# Altium project fMUX_MB.PrjPCB (part 6 of 6)
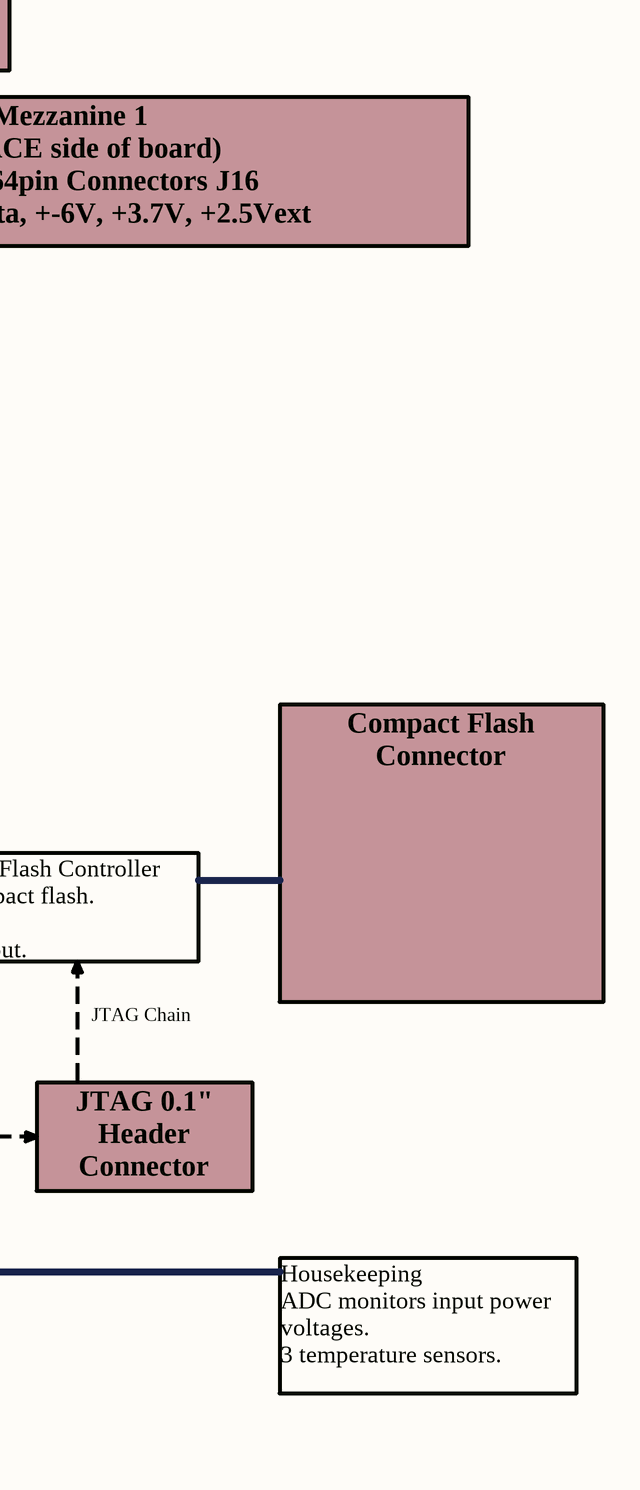
[diagram p29: fMuxBoardOverview.SchDoc, right]

## Nets that join several sheets
EXT5V5n: Power_Delivery (F2.1 P4.2), Eurocard VME 6U P2 (P2.B1 P2.B13 P2.B32), Housekeeping (RP18.2)
EXT5V5p: Power_Delivery (F1.1 P4.5), Eurocard VME 6U P1 (P1.A32 P1.B32 P1.C32), Housekeeping (RP10.2)
GND: Banks_1_2 (14 pins), Banks_3_4 (7 pins), Banks_5_6 (7 pins), Banks_7_8 (12 pins), Banks_9_10 (R123.2 R126.1), Banks_11_12 (R28.2 R29.1), Banks_13_14 (R31.2 R33.1), Power_Delivery (14 pins), U_Power_Delivery/BuckRegulator1 (27 pins), U_Power_Delivery/BuckRegulator2 (27 pins), U_Power_Delivery/BuckRegulator3 (27 pins), Linear_Pos_regulator (C325.2 C326.2 U33.3 U33.6), Clock_distrubution (7 pins), UserClock (C4.1 U5.2), DDR-Memory (36 pins), U_DDR-Memory/RTerm1 (CRT1_1.1), U_DDR-Memory/RTerm2 (CRT1_2.1), U_DDR-Memory/RTerm3 (CRT1_3.1), U_DDR-Memory/RTerm4 (CRT1_4.1), U_DDR-Memory/RTerm5 (CRT1_5.1), U_DDR-Memory/RTerm6 (CRT1_6.1), U_DDR-Memory/RTerm7 (CRT1_7.1), U_DDR-Memory/RTerm8 (CRT1_8.1), Eurocard VME 6U P1 (24 pins), Eurocard VME 6U P2 (6 pins), FPGA_Power (344 pins), Housekeeping (13 pins), U_Housekeeping/TemperatureSens1 (CTemp_1.2 UTemp_1.1), U_Housekeeping/TemperatureSens2 (CTemp_2.2 UTemp_2.1), U_Housekeeping/TemperatureSens3 (CTemp_3.2 UTemp_3.1), Mezz1 (13 pins), Mezz2 (13 pins), SysACE_SysFLASH (62 pins), Watchdog_Reset (R132.1 U29.2), Comm_SQUID (14 pins), SQUID_Power (22 pins), PHY_RJ45 (54 pins)
INT5V5n: Power_Delivery (C275.2 C276.2 L6.2), Housekeeping (RP5.1), Mezz1 (J16_2.83 J16_2.84), Mezz2 (J17_2.83 J17_2.84), SQUID_Power (C330.2 Q6.3 R160.2)
INT5V5p: Power_Delivery (5 pins), U_Power_Delivery/BuckRegulator1 (14 pins), U_Power_Delivery/BuckRegulator2 (14 pins), U_Power_Delivery/BuckRegulator3 (14 pins), Housekeeping (RP8.2), Mezz1 (J16_2.77 J16_2.78), Mezz2 (J17_2.77 J17_2.78), SQUID_Power (C327.1 Q4.3 R156.2)
VAuxN: Power_Delivery (P4.1), Eurocard VME 6U P1 (P1.A31), Housekeeping (RP3.1), SQUID_Power (C336.2 F4.1)
VAuxP: Power_Delivery (P4.6), Eurocard VME 6U P1 (P1.C31), Housekeeping (RP14.2), SQUID_Power (C333.1 F3.1)
VCC3V3: Banks_1_2 (22 pins), Banks_7_8 (18 pins), Banks_9_10 (20 pins), Banks_11_12 (R26.2 R27.1), Banks_13_14 (R30.2 R32.1), Power_Delivery (R79.2), Linear_Pos_regulator (C326.1 U33.4 U33.5), Clock_distrubution (9 pins), UserClock (C4.2 U5.1 U5.4), Eurocard VME 6U P1 (CT1.1 CT2.1 U27.31 U27.42), FPGA_Power (35 pins), Housekeeping (8 pins), U_Housekeeping/TemperatureSens1 (CTemp_1.1 UTemp_1.3), U_Housekeeping/TemperatureSens2 (CTemp_2.1 UTemp_2.3), U_Housekeeping/TemperatureSens3 (CTemp_3.1 UTemp_3.3), SysACE_SysFLASH (56 pins), Watchdog_Reset (R130.2), Comm_SQUID (7 pins), PHY_RJ45 (C400.1 C401.1 R452.1 Uphy.5)
Vout1: U_Power_Delivery/BuckRegulator1 (6 pins), Linear_Pos_regulator (C325.1 R154.2 U33.2), Mezz1 (J16_2.79 J16_2.80 J16_2.81 J16_2.82), Mezz2 (J17_2.79 J17_2.80 J17_2.81 J17_2.82)
Vout2: Banks_1_2 (8 pins), Banks_3_4 (9 pins), Banks_5_6 (19 pins), Banks_7_8 (9 pins), Banks_11_12 (18 pins), Banks_13_14 (16 pins), Power_Delivery (R75.2 R78.2), U_Power_Delivery/BuckRegulator2 (6 pins), DDR-Memory (31 pins), Eurocard VME 6U P1 (CT3.1 CT4.1 U27.7 U27.18), FPGA_Power (111 pins), Mezz1 (J16_1.1 J16_1.2 J16_2.1 J16_2.2), Mezz2 (J17_1.1 J17_1.2 J17_2.1 J17_2.2), SysACE_SysFLASH (R82.2 R95.2 R101.2 R103.2), Watchdog_Reset (5 pins), PHY_RJ45 (39 pins)
Vout3: U_Power_Delivery/BuckRegulator3 (6 pins), FPGA_Power (138 pins), Watchdog_Reset (U29.6), PHY_RJ45 (16 pins)
VTTDDR: Banks_5_6 (7 pins), DDR-Memory (8 pins), U_DDR-Memory/RTerm1 (9 pins), U_DDR-Memory/RTerm2 (9 pins), U_DDR-Memory/RTerm3 (9 pins), U_DDR-Memory/RTerm4 (9 pins), U_DDR-Memory/RTerm5 (9 pins), U_DDR-Memory/RTerm6 (9 pins), U_DDR-Memory/RTerm7 (9 pins), U_DDR-Memory/RTerm8 (9 pins)
BP_MASTER0: Banks_7_8 (U1.AK29), Eurocard VME 6U P2 (P2.C1)
BP_MASTER1: Banks_7_8 (U1.AJ29), Eurocard VME 6U P2 (P2.C2)
BP_MASTER2: Banks_7_8 (U1.AF28), Eurocard VME 6U P2 (P2.C3)
BP_MASTER3: Banks_7_8 (U1.AE27), Eurocard VME 6U P2 (P2.C4)
BP_MASTER4: Banks_7_8 (U1.AF26), Eurocard VME 6U P2 (P2.C5)
BP_MASTER5: Banks_7_8 (U1.AE26), Eurocard VME 6U P2 (P2.C6)
BP_RS485AN: Eurocard VME 6U P2 (RT13.6), Comm_SQUID (R9.2)
BP_RS485AP: Eurocard VME 6U P2 (RT13.5), Comm_SQUID (R8.2)
BP_RS485BN: Eurocard VME 6U P2 (RT13.8), Comm_SQUID (R6.2)
BP_RS485BP: Eurocard VME 6U P2 (RT13.7), Comm_SQUID (R5.2)
CS1: Banks_1_2 (U1.AB15), U_Housekeeping/TemperatureSens1 (UTemp_1.5)
CS2: Banks_1_2 (U1.AJ21), U_Housekeeping/TemperatureSens2 (UTemp_2.5)
CS3: Banks_1_2 (U1.AJ22), U_Housekeeping/TemperatureSens3 (UTemp_3.5)
DDR_A0: Banks_5_6 (U1.C29), DDR-Memory (U12.29 U13.29), U_DDR-Memory/RTerm1 (RT1_1.14)
DDR_A1: Banks_5_6 (U1.C23), DDR-Memory (U12.30 U13.30), U_DDR-Memory/RTerm1 (RT1_1.13)
DDR_A2: Banks_5_6 (U1.D25), DDR-Memory (U12.31 U13.31), U_DDR-Memory/RTerm1 (RT1_1.12)
DDR_A3: Banks_5_6 (U1.D24), DDR-Memory (U12.32 U13.32), U_DDR-Memory/RTerm1 (RT1_1.11)
DDR_A4: Banks_5_6 (U1.C24), DDR-Memory (U12.35 U13.35), U_DDR-Memory/RTerm1 (RT1_1.9)
DDR_A5: Banks_5_6 (U1.G25), DDR-Memory (U12.36 U13.36), U_DDR-Memory/RTerm1 (RT1_1.10)
DDR_A6: Banks_5_6 (U1.B26), DDR-Memory (U12.37 U13.37), U_DDR-Memory/RTerm5 (RT1_5.16)
DDR_A7: Banks_5_6 (U1.A26), DDR-Memory (U12.38 U13.38), U_DDR-Memory/RTerm5 (RT1_5.15)
DDR_A8: Banks_5_6 (U1.A24), DDR-Memory (U12.39 U13.39), U_DDR-Memory/RTerm5 (RT1_5.14)
DDR_A9: Banks_5_6 (U1.F25), DDR-Memory (U12.40 U13.40), U_DDR-Memory/RTerm5 (RT1_5.13)
DDR_A10: Banks_5_6 (U1.A25), DDR-Memory (U12.28 U13.28), U_DDR-Memory/RTerm1 (RT1_1.15)
DDR_A11: Banks_5_6 (U1.F26), DDR-Memory (U12.41 U13.41), U_DDR-Memory/RTerm5 (RT1_5.12)
DDR_A12: Banks_5_6 (U1.B27), DDR-Memory (U12.42 U13.42), U_DDR-Memory/RTerm5 (RT1_5.11)
DDR_A13: Banks_3_4 (U1.K17), DDR-Memory (U12.17 U13.17), U_DDR-Memory/RTerm6 (RT1_6.15)
DDR_BA0: Banks_3_4 (U1.E17), DDR-Memory (U12.26 U13.26), U_DDR-Memory/RTerm6 (RT1_6.9)
DDR_BA1: Banks_3_4 (U1.K18), DDR-Memory (U12.27 U13.27), U_DDR-Memory/RTerm1 (RT1_1.16)
DDR_CAS_N: Banks_5_6 (U1.B31), DDR-Memory (U12.22 U13.22), U_DDR-Memory/RTerm6 (RT1_6.12)
DDR_CK1_N: Banks_3_4 (U1.F16), DDR-Memory (U12.46 U13.46), U_DDR-Memory/RTerm2 (RT1_2.16)
DDR_CK1_P: Banks_3_4 (U1.E16 U1.E18), DDR-Memory (U12.45 U13.45), U_DDR-Memory/RTerm5 (RT1_5.9)
DDR_CKE: Banks_5_6 (R15.1 U1.E22), DDR-Memory (U12.44 U13.44), U_DDR-Memory/RTerm5 (RT1_5.10)
DDR_CS_N: Banks_5_6 (R14.2 U1.D22), DDR-Memory (U12.24 U13.24), U_DDR-Memory/RTerm6 (RT1_6.10)
DDR_D0: Banks_5_6 (U1.E28), DDR-Memory (U12.2), U_DDR-Memory/RTerm8 (RT1_8.16)
DDR_D1: Banks_5_6 (U1.A30), DDR-Memory (U12.4), U_DDR-Memory/RTerm8 (RT1_8.15)
DDR_D2: Banks_5_6 (U1.E31), DDR-Memory (U12.5), U_DDR-Memory/RTerm8 (RT1_8.14)
DDR_D3: Banks_5_6 (U1.D30), DDR-Memory (U12.7), U_DDR-Memory/RTerm8 (RT1_8.13)
DDR_D4: Banks_5_6 (U1.G27), DDR-Memory (U12.8), U_DDR-Memory/RTerm8 (RT1_8.12)
DDR_D5: Banks_5_6 (U1.E29), DDR-Memory (U12.10), U_DDR-Memory/RTerm8 (RT1_8.11)
DDR_D6: Banks_5_6 (U1.D29), DDR-Memory (U12.11), U_DDR-Memory/RTerm8 (RT1_8.10)
DDR_D7: Banks_5_6 (U1.G28), DDR-Memory (U12.13), U_DDR-Memory/RTerm8 (RT1_8.9)
DDR_D8: Banks_5_6 (U1.J24), DDR-Memory (U12.54), U_DDR-Memory/RTerm7 (RT1_7.16)
DDR_D9: Banks_5_6 (U1.B25), DDR-Memory (U12.56), U_DDR-Memory/RTerm7 (RT1_7.15)
DDR_D10: Banks_5_6 (U1.A21), DDR-Memory (U12.57), U_DDR-Memory/RTerm7 (RT1_7.14)
DDR_D11: Banks_5_6 (U1.K26), DDR-Memory (U12.59), U_DDR-Memory/RTerm7 (RT1_7.13)
DDR_D12: Banks_5_6 (U1.G23), DDR-Memory (U12.60), U_DDR-Memory/RTerm7 (RT1_7.12)
DDR_D13: Banks_5_6 (U1.C25), DDR-Memory (U12.62), U_DDR-Memory/RTerm7 (RT1_7.11)
DDR_D14: Banks_5_6 (U1.J25), DDR-Memory (U12.63), U_DDR-Memory/RTerm7 (RT1_7.10)
DDR_D15: Banks_5_6 (U1.E24), DDR-Memory (U12.65), U_DDR-Memory/RTerm7 (RT1_7.9)
DDR_D16: Banks_5_6 (U1.F24), DDR-Memory (U13.2), U_DDR-Memory/RTerm3 (RT1_3.16)
DDR_D17: Banks_5_6 (U1.H24), DDR-Memory (U13.4), U_DDR-Memory/RTerm3 (RT1_3.15)
DDR_D18: Banks_5_6 (U1.B22), DDR-Memory (U13.5), U_DDR-Memory/RTerm3 (RT1_3.14)
DDR_D19: Banks_5_6 (U1.E26), DDR-Memory (U13.7), U_DDR-Memory/RTerm3 (RT1_3.13)
DDR_D20: Banks_5_6 (U1.D27), DDR-Memory (U13.8), U_DDR-Memory/RTerm3 (RT1_3.12)
DDR_D21: Banks_5_6 (U1.A28), DDR-Memory (U13.10), U_DDR-Memory/RTerm3 (RT1_3.11)
DDR_D22: Banks_5_6 (U1.B21), DDR-Memory (U13.11), U_DDR-Memory/RTerm3 (RT1_3.10)
DDR_D23: Banks_5_6 (U1.D26), DDR-Memory (U13.13), U_DDR-Memory/RTerm3 (RT1_3.9)
DDR_D24: Banks_5_6 (U1.B30), DDR-Memory (U13.54), U_DDR-Memory/RTerm4 (RT1_4.16)
DDR_D25: Banks_5_6 (U1.K24), DDR-Memory (U13.56), U_DDR-Memory/RTerm4 (RT1_4.15)
DDR_D26: Banks_5_6 (U1.L26), DDR-Memory (U13.57), U_DDR-Memory/RTerm4 (RT1_4.14)
DDR_D27: Banks_5_6 (U1.B33), DDR-Memory (U13.59), U_DDR-Memory/RTerm4 (RT1_4.13)
DDR_D28: Banks_5_6 (U1.B32), DDR-Memory (U13.60), U_DDR-Memory/RTerm4 (RT1_4.12)
DDR_D29: Banks_5_6 (U1.F31), DDR-Memory (U13.62), U_DDR-Memory/RTerm4 (RT1_4.11)
DDR_D30: Banks_5_6 (U1.L25), DDR-Memory (U13.63), U_DDR-Memory/RTerm4 (RT1_4.10)
DDR_D31: Banks_5_6 (U1.D31), DDR-Memory (U13.65), U_DDR-Memory/RTerm4 (RT1_4.9)
DDR_DM0: Banks_5_6 (U1.C22), DDR-Memory (U12.20), U_DDR-Memory/RTerm6 (RT1_6.14)
DDR_DM1: Banks_5_6 (U1.F29), DDR-Memory (U12.47), U_DDR-Memory/RTerm2 (RT1_2.14)
DDR_DM2: Banks_5_6 (U1.F28), DDR-Memory (U13.20), U_DDR-Memory/RTerm2 (RT1_2.12)
DDR_DM3: Banks_5_6 (U1.A29), DDR-Memory (U13.47), U_DDR-Memory/RTerm2 (RT1_2.15)
DDR_DQS0: Banks_5_6 (U1.C28), DDR-Memory (U12.16), U_DDR-Memory/RTerm6 (RT1_6.16)
DDR_DQS1: Banks_5_6 (U1.F23), DDR-Memory (U12.51), U_DDR-Memory/RTerm2 (RT1_2.13)
DDR_DQS2: Banks_5_6 (U1.E23), DDR-Memory (U13.16), U_DDR-Memory/RTerm2 (RT1_2.11)
DDR_DQS3: Banks_5_6 (U1.B28), DDR-Memory (U13.51), U_DDR-Memory/RTerm2 (RT1_2.10)
DDR_RAS_N: Banks_5_6 (U1.A31), DDR-Memory (U12.23 U13.23), U_DDR-Memory/RTerm6 (RT1_6.11)
DDR_WE_N: Banks_5_6 (U1.C27), DDR-Memory (U12.21 U13.21), U_DDR-Memory/RTerm6 (RT1_6.13)
FDI: Banks_7_8 (U1.AP24), Watchdog_Reset (R133.1)
FDT: Banks_7_8 (U1.AN24), Watchdog_Reset (U29.3)
FP_LVDS_AN: Banks_7_8 (U1.AM23), Comm_SQUID (P5.2 R12.2)
FP_LVDS_AP: Banks_7_8 (U1.AL23), Comm_SQUID (P5.1 R12.1)
FP_LVDS_BN: Banks_7_8 (U1.AM25), Comm_SQUID (P5.6 R11.2)
FP_LVDS_BP: Banks_7_8 (U1.AN25), Comm_SQUID (P5.3 R11.1)
FPGA_CLK_FS: Banks_1_2 (U1.AL20), Comm_SQUID (U9.14)
FPGA_CLK_TS: Banks_1_2 (U1.AL15), Comm_SQUID (U9.10)
FPGA_DATA_FS: Banks_1_2 (U1.AJ20), Comm_SQUID (U9.15)
FPGA_DATA_TS: Banks_1_2 (U1.AM15), Comm_SQUID (U9.11)
FPGA_REGULATOR_SYNC: Banks_1_2 (U1.AB18), Power_Delivery (R77.2)
FPGA_SQUID_ENABLE: Banks_1_2 (U1.AD20), Comm_SQUID (R13.2 U9.16), SQUID_Power (Q7.2 R158.1 R159.2)
FVC: Banks_1_2 (U1.AE21 U1.AF21), Watchdog_Reset (J24.2)
m1_aux0: Banks_11_12 (U1.AG30), Mezz1 (J16_1.41)
m1_aux1: Banks_11_12 (U1.AG31), Mezz1 (J16_1.42)
m1_aux2: Banks_13_14 (U1.T31), Mezz1 (J16_2.21)
m1_aux3: Banks_13_14 (U1.R32), Mezz1 (J16_2.22)
m1_aux4: Banks_13_14 (U1.R33), Mezz1 (J16_2.23)
m1_clock1: Banks_11_12 (U1.AH32), Mezz1 (J16_1.43)
m1_clock2: Banks_11_12 (U1.AH33), Mezz1 (J16_1.44)
m1_clock3: Banks_13_14 (U1.T28), Mezz1 (J16_2.24)
m1_Comb1_data0: Banks_13_14 (U1.W30), Mezz1 (J16_2.49)
m1_Comb1_data1: Banks_13_14 (U1.V30), Mezz1 (J16_2.50)
m1_Comb1_data2: Banks_13_14 (U1.Y32), Mezz1 (J16_2.51)
m1_Comb1_data3: Banks_13_14 (U1.Y33), Mezz1 (J16_2.52)
m1_Comb1_data4: Banks_13_14 (U1.W27), Mezz1 (J16_2.53)
m1_Comb1_data5: Banks_13_14 (U1.V27), Mezz1 (J16_2.54)
m1_Comb1_data6: Banks_13_14 (U1.Y29), Mezz1 (J16_2.55)
m1_Comb1_data7: Banks_13_14 (U1.W29), Mezz1 (J16_2.56)
m1_Comb1_data8: Banks_13_14 (U1.Y31), Mezz1 (J16_2.57)
m1_Comb1_data9: Banks_13_14 (U1.W31), Mezz1 (J16_2.58)
m1_Comb1_data10: Banks_13_14 (U1.AB32), Mezz1 (J16_2.59)
m1_Comb1_data11: Banks_13_14 (U1.AB33), Mezz1 (J16_2.60)
m1_Comb1_data12: Banks_13_14 (U1.AA33), Mezz1 (J16_2.61)
m1_Comb1_data13: Banks_13_14 (U1.AA34), Mezz1 (J16_2.62)
m1_Comb1_data14: Banks_13_14 (U1.AB31), Mezz1 (J16_2.63)
m1_Comb1_data15: Banks_13_14 (U1.AA31), Mezz1 (J16_2.64)
m1_Comb1_s0: Banks_13_14 (U1.W32), Mezz1 (J16_2.47)
m1_Comb1_s1: Banks_13_14 (U1.V32), Mezz1 (J16_2.48)
m1_Comb2_data0: Banks_13_14 (U1.T33), Mezz1 (J16_2.29)
m1_Comb2_data1: Banks_13_14 (U1.T34), Mezz1 (J16_2.30)
m1_Comb2_data2: Banks_13_14 (U1.U26), Mezz1 (J16_2.31)
m1_Comb2_data3: Banks_13_14 (U1.U27), Mezz1 (J16_2.32)
m1_Comb2_data4: Banks_13_14 (U1.U30), Mezz1 (J16_2.33)
m1_Comb2_data5: Banks_13_14 (U1.U31), Mezz1 (J16_2.34)
m1_Comb2_data6: Banks_13_14 (U1.V33), Mezz1 (J16_2.35)
m1_Comb2_data7: Banks_13_14 (U1.V34), Mezz1 (J16_2.36)
m1_Comb2_data8: Banks_13_14 (U1.U32), Mezz1 (J16_2.37)
m1_Comb2_data9: Banks_13_14 (U1.U33), Mezz1 (J16_2.38)
m1_Comb2_data10: Banks_13_14 (U1.V25), Mezz1 (J16_2.39)
m1_Comb2_data11: Banks_13_14 (U1.U25), Mezz1 (J16_2.40)
m1_Comb2_data12: Banks_13_14 (U1.V28), Mezz1 (J16_2.41)
m1_Comb2_data13: Banks_13_14 (U1.V29), Mezz1 (J16_2.42)
m1_Comb2_data14: Banks_13_14 (U1.V23), Mezz1 (J16_2.43)
m1_Comb2_data15: Banks_13_14 (U1.V24), Mezz1 (J16_2.44)
m1_Comb2_s0: Banks_13_14 (U1.T29), Mezz1 (J16_2.27)
m1_Comb2_s1: Banks_13_14 (U1.T30), Mezz1 (J16_2.28)
m1_Comb3_data0: Banks_11_12 (U1.AC28), Mezz1 (J16_1.23)
m1_Comb3_data1: Banks_11_12 (U1.AB28), Mezz1 (J16_1.24)
m1_Comb3_data2: Banks_11_12 (U1.AD30), Mezz1 (J16_1.25)
m1_Comb3_data3: Banks_11_12 (U1.AD31), Mezz1 (J16_1.26)
m1_Comb3_data4: Banks_11_12 (U1.AG32), Mezz1 (J16_1.27)
m1_Comb3_data5: Banks_11_12 (U1.AG33), Mezz1 (J16_1.28)
m1_Comb3_data6: Banks_11_12 (U1.AF33), Mezz1 (J16_1.29)
m1_Comb3_data7: Banks_11_12 (U1.AF34), Mezz1 (J16_1.30)
m1_Comb3_data8: Banks_11_12 (U1.AE29), Mezz1 (J16_1.31)
m1_Comb3_data9: Banks_11_12 (U1.AD29), Mezz1 (J16_1.32)
m1_Comb3_data10: Banks_11_12 (U1.AF31), Mezz1 (J16_1.33)
m1_Comb3_data11: Banks_11_12 (U1.AE31), Mezz1 (J16_1.34)
m1_Comb3_data12: Banks_11_12 (U1.AA23), Mezz1 (J16_1.35)
m1_Comb3_data13: Banks_11_12 (U1.AA24), Mezz1 (J16_1.36)
m1_Comb3_data14: Banks_11_12 (U1.AJ34), Mezz1 (J16_1.37)
m1_Comb3_data15: Banks_11_12 (U1.AH34), Mezz1 (J16_1.38)
m1_Comb3_s0: Banks_11_12 (U1.AC27), Mezz1 (J16_1.39)
m1_Comb3_s1: Banks_11_12 (U1.AB25), Mezz1 (J16_1.40)
m1_Comb4_data0: Banks_11_12 (U1.AA28), Mezz1 (J16_1.3)
m1_Comb4_data1: Banks_11_12 (U1.AA29), Mezz1 (J16_1.4)
m1_Comb4_data2: Banks_11_12 (U1.W24), Mezz1 (J16_1.5)
m1_Comb4_data3: Banks_11_12 (U1.Y24), Mezz1 (J16_1.6)
m1_Comb4_data4: Banks_11_12 (U1.AB30), Mezz1 (J16_1.7)
m1_Comb4_data5: Banks_11_12 (U1.AA30), Mezz1 (J16_1.8)
m1_Comb4_data6: Banks_11_12 (U1.W25), Mezz1 (J16_1.9)
m1_Comb4_data7: Banks_11_12 (U1.Y26), Mezz1 (J16_1.10)
m1_Comb4_data8: Banks_11_12 (U1.AE33), Mezz1 (J16_1.11)
m1_Comb4_data9: Banks_11_12 (U1.AE34), Mezz1 (J16_1.12)
m1_Comb4_data10: Banks_11_12 (U1.AC32), Mezz1 (J16_1.13)
m1_Comb4_data11: Banks_11_12 (U1.AC33), Mezz1 (J16_1.14)
m1_Comb4_data12: Banks_11_12 (U1.AC29), Mezz1 (J16_1.15)
m1_Comb4_data13: Banks_11_12 (U1.AC30), Mezz1 (J16_1.16)
m1_Comb4_data14: Banks_11_12 (U1.AD34), Mezz1 (J16_1.17)
m1_Comb4_data15: Banks_11_12 (U1.AC34), Mezz1 (J16_1.18)
m1_Comb4_s0: Banks_11_12 (U1.AA26), Mezz1 (J16_1.21)
m1_Comb4_s1: Banks_11_12 (U1.AE32), Mezz1 (J16_1.22)
m1_DemodA_data0: Banks_13_14 (U1.T23), Mezz1 (J16_2.3)
m1_DemodA_data1: Banks_13_14 (U1.U23), Mezz1 (J16_2.4)
m1_DemodA_data2: Banks_13_14 (U1.R26), Mezz1 (J16_2.5)
m1_DemodA_data3: Banks_13_14 (U1.T26), Mezz1 (J16_2.6)
m1_DemodA_data4: Banks_13_14 (U1.T24), Mezz1 (J16_2.7)
m1_DemodA_data5: Banks_13_14 (U1.T25), Mezz1 (J16_2.8)
m1_DemodA_data6: Banks_13_14 (U1.R27), Mezz1 (J16_2.9)
m1_DemodA_data7: Banks_13_14 (U1.R28), Mezz1 (J16_2.10)
m1_DemodA_data8: Banks_13_14 (U1.P29), Mezz1 (J16_2.11)
m1_DemodA_data9: Banks_13_14 (U1.R29), Mezz1 (J16_2.12)
m1_DemodA_data10: Banks_13_14 (U1.N32), Mezz1 (J16_2.13)
m1_DemodA_data11: Banks_13_14 (U1.P32), Mezz1 (J16_2.14)
m1_DemodA_data12: Banks_13_14 (U1.P30), Mezz1 (J16_2.15)
m1_DemodA_data13: Banks_13_14 (U1.P31), Mezz1 (J16_2.16)
m1_DemodA_data14: Banks_13_14 (U1.N33), Mezz1 (J16_2.17)
m1_DemodA_dataX: Banks_13_14 (U1.P34), Mezz1 (J16_2.18)
m1_DemodA_s0: Banks_13_14 (U1.R34), Mezz1 (J16_2.19)
m1_DemodA_s1: Banks_13_14 (U1.R31), Mezz1 (J16_2.20)
m1_DemodB_data0: Banks_11_12 (U1.AK32), Mezz1 (J16_1.50)
m1_DemodB_data1: Banks_11_12 (U1.AK33), Mezz1 (J16_1.51)
m1_DemodB_data2: Banks_11_12 (U1.AK34), Mezz1 (J16_1.52)
m1_DemodB_data3: Banks_11_12 (U1.AM32), Mezz1 (J16_1.53)
m1_DemodB_data4: Banks_11_12 (U1.AM33), Mezz1 (J16_1.54)
m1_DemodB_data5: Banks_11_12 (U1.AJ31), Mezz1 (J16_1.55)
m1_DemodB_data6: Banks_11_12 (U1.AJ32), Mezz1 (J16_1.56)
m1_DemodB_data7: Banks_11_12 (U1.AB22), Mezz1 (J16_1.57)
m1_DemodB_data8: Banks_11_12 (U1.AB23), Mezz1 (J16_1.58)
m1_DemodB_data9: Banks_11_12 (U1.AL33), Mezz1 (J16_1.59)
m1_DemodB_data10: Banks_11_12 (U1.AL34), Mezz1 (J16_1.60)
m1_DemodB_data11: Banks_11_12 (U1.AM31), Mezz1 (J16_1.61)
m1_DemodB_data12: Banks_11_12 (U1.AL31), Mezz1 (J16_1.62)
m1_DemodB_data13: Banks_11_12 (U1.AJ30), Mezz1 (J16_1.63)
m1_DemodB_data14: Banks_11_12 (U1.AH30), Mezz1 (J16_1.64)
m1_DemodB_dataX: Banks_11_12 (U1.AK31), Mezz1 (J16_1.49)
m1_DemodB_s0: Banks_11_12 (U1.AF29), Mezz1 (J16_1.47)
m1_DemodB_s1: Banks_11_12 (U1.AF30), Mezz1 (J16_1.48)
m1_power_data0: Banks_3_4 (U1.AG18), Mezz1 (J16_2.67)
m1_power_data1: Banks_3_4 (U1.AG17), Mezz1 (J16_2.68)
m1_power_data2: Banks_3_4 (U1.AE17), Mezz1 (J16_2.69)
m1_power_data3: Banks_3_4 (U1.AE16), Mezz1 (J16_2.70)
m1_power_data4: Banks_3_4 (U1.AJ19), Mezz1 (J16_2.71)
m1_power_data5: Banks_3_4 (U1.AK19), Mezz1 (J16_2.72)
m1_power_data6: Banks_3_4 (U1.AJ17), Mezz1 (J16_2.73)
m1_power_data7: Banks_3_4 (U1.AH17), Mezz1 (J16_2.74 Rv2_2.2)
m2_aux0: Banks_11_12 (U1.AL1), Mezz2 (J17_1.41)
m2_aux1: Banks_11_12 (U1.AK1), Mezz2 (J17_1.42)
m2_aux2: Banks_13_14 (U1.U3), Mezz2 (J17_2.21)
m2_aux3: Banks_13_14 (U1.U8), Mezz2 (J17_2.22)
m2_aux4: Banks_13_14 (U1.U7), Mezz2 (J17_2.23)
m2_clock1: Banks_11_12 (U1.AJ2), Mezz2 (J17_1.43)
m2_clock2: Banks_11_12 (U1.AJ1), Mezz2 (J17_1.44)
m2_clock3: Banks_13_14 (U1.U2), Mezz2 (J17_2.24)
m2_Comb1_data0: Banks_13_14 (U1.Y3), Mezz2 (J17_2.49)
m2_Comb1_data1: Banks_13_14 (U1.Y2), Mezz2 (J17_2.50)
m2_Comb1_data2: Banks_13_14 (U1.AA5), Mezz2 (J17_2.51)
m2_Comb1_data3: Banks_13_14 (U1.AA4), Mezz2 (J17_2.52)
m2_Comb1_data4: Banks_13_14 (U1.AA1), Mezz2 (J17_2.53)
m2_Comb1_data5: Banks_13_14 (U1.Y1), Mezz2 (J17_2.54)
m2_Comb1_data6: Banks_13_14 (U1.AB3), Mezz2 (J17_2.55)
m2_Comb1_data7: Banks_13_14 (U1.AA3), Mezz2 (J17_2.56)
m2_Comb1_data8: Banks_13_14 (U1.AB2), Mezz2 (J17_2.57)
m2_Comb1_data9: Banks_13_14 (U1.AB1), Mezz2 (J17_2.58)
m2_Comb1_data10: Banks_13_14 (U1.AA6), Mezz2 (J17_2.59)
m2_Comb1_data11: Banks_13_14 (U1.Y6), Mezz2 (J17_2.60)
m2_Comb1_data12: Banks_13_14 (U1.Y8), Mezz2 (J17_2.61)
m2_Comb1_data13: Banks_13_14 (U1.Y7), Mezz2 (J17_2.62)
m2_Comb1_data14: Banks_13_14 (U1.Y9), Mezz2 (J17_2.63)
m2_Comb1_data15: Banks_13_14 (U1.W9), Mezz2 (J17_2.64)
m2_Comb1_s0: Banks_13_14 (U1.W7), Mezz2 (J17_2.47)
m2_Comb1_s1: Banks_13_14 (U1.V7), Mezz2 (J17_2.48)
m2_Comb2_data0: Banks_13_14 (U1.U10), Mezz2 (J17_2.29)
m2_Comb2_data1: Banks_13_14 (U1.V10), Mezz2 (J17_2.30)
m2_Comb2_data2: Banks_13_14 (U1.U6), Mezz2 (J17_2.31)
m2_Comb2_data3: Banks_13_14 (U1.U5), Mezz2 (J17_2.32)
m2_Comb2_data4: Banks_13_14 (U1.V3), Mezz2 (J17_2.33)
m2_Comb2_data5: Banks_13_14 (U1.V2), Mezz2 (J17_2.34)
m2_Comb2_data6: Banks_13_14 (U1.V9), Mezz2 (J17_2.35)
m2_Comb2_data7: Banks_13_14 (U1.V8), Mezz2 (J17_2.36)
m2_Comb2_data8: Banks_13_14 (U1.V5), Mezz2 (J17_2.37)
m2_Comb2_data9: Banks_13_14 (U1.V4), Mezz2 (J17_2.38)
m2_Comb2_data10: Banks_13_14 (U1.W6), Mezz2 (J17_2.39)
m2_Comb2_data11: Banks_13_14 (U1.W5), Mezz2 (J17_2.40)
m2_Comb2_data12: Banks_13_14 (U1.W2), Mezz2 (J17_2.41)
m2_Comb2_data13: Banks_13_14 (U1.W1), Mezz2 (J17_2.42)
m2_Comb2_data14: Banks_13_14 (U1.V12), Mezz2 (J17_2.43)
m2_Comb2_data15: Banks_13_14 (U1.W12), Mezz2 (J17_2.44)
m2_Comb2_s0: Banks_13_14 (U1.U12), Mezz2 (J17_2.27)
m2_Comb2_s1: Banks_13_14 (U1.U11), Mezz2 (J17_2.28)
m2_Comb3_data0: Banks_11_12 (U1.AD6), Mezz2 (J17_1.23)
m2_Comb3_data1: Banks_11_12 (U1.AD5), Mezz2 (J17_1.24)
m2_Comb3_data2: Banks_11_12 (U1.AC7), Mezz2 (J17_1.25)
m2_Comb3_data3: Banks_11_12 (U1.AB8), Mezz2 (J17_1.26)
m2_Comb3_data4: Banks_11_12 (U1.Y16), Mezz2 (J17_1.27)
m2_Comb3_data5: Banks_11_12 (U1.AA15), Mezz2 (J17_1.28)
m2_Comb3_data6: Banks_11_12 (U1.AE4), Mezz2 (J17_1.29)
m2_Comb3_data7: Banks_11_12 (U1.AD4), Mezz2 (J17_1.30)
m2_Comb3_data8: Banks_11_12 (U1.AH3), Mezz2 (J17_1.31)
m2_Comb3_data9: Banks_11_12 (U1.AH2), Mezz2 (J17_1.32)
m2_Comb3_data10: Banks_11_12 (U1.AG2), Mezz2 (J17_1.33)
m2_Comb3_data11: Banks_11_12 (U1.AG1), Mezz2 (J17_1.34)
m2_Comb3_data12: Banks_11_12 (U1.AC9), Mezz2 (J17_1.35)
m2_Comb3_data13: Banks_11_12 (U1.AC8), Mezz2 (J17_1.36)
m2_Comb3_data14: Banks_11_12 (U1.AG3), Mezz2 (J17_1.37)
m2_Comb3_data15: Banks_11_12 (U1.AF3), Mezz2 (J17_1.38)
m2_Comb3_s0: Banks_11_12 (U1.AE6), Mezz2 (J17_1.39)
m2_Comb3_s1: Banks_11_12 (U1.AF5), Mezz2 (J17_1.40)
m2_Comb4_data0: Banks_11_12 (U1.AB6), Mezz2 (J17_1.3)
m2_Comb4_data1: Banks_11_12 (U1.AB5), Mezz2 (J17_1.4)
m2_Comb4_data2: Banks_11_12 (U1.AC3), Mezz2 (J17_1.5)
m2_Comb4_data3: Banks_11_12 (U1.AC2), Mezz2 (J17_1.6)
m2_Comb4_data4: Banks_11_12 (U1.Y11), Mezz2 (J17_1.7)
m2_Comb4_data5: Banks_11_12 (U1.AA11), Mezz2 (J17_1.8)
m2_Comb4_data6: Banks_11_12 (U1.AD2), Mezz2 (J17_1.9)
m2_Comb4_data7: Banks_11_12 (U1.AD1), Mezz2 (J17_1.10)
m2_Comb4_data8: Banks_11_12 (U1.Y14), Mezz2 (J17_1.11)
m2_Comb4_data9: Banks_11_12 (U1.AA13), Mezz2 (J17_1.12)
m2_Comb4_data10: Banks_11_12 (U1.AC5), Mezz2 (J17_1.13)
m2_Comb4_data11: Banks_11_12 (U1.AC4), Mezz2 (J17_1.14)
m2_Comb4_data12: Banks_11_12 (U1.AF1), Mezz2 (J17_1.15)
m2_Comb4_data13: Banks_11_12 (U1.AE1), Mezz2 (J17_1.16)
m2_Comb4_data14: Banks_11_12 (U1.AA9), Mezz2 (J17_1.17)
m2_Comb4_data15: Banks_11_12 (U1.AA8), Mezz2 (J17_1.18)
m2_Comb4_s0: Banks_11_12 (U1.Y12), Mezz2 (J17_1.21)
m2_Comb4_s1: Banks_11_12 (U1.AE3), Mezz2 (J17_1.22)
m2_DemodA_data0: Banks_13_14 (U1.N4), Mezz2 (J17_2.3)
m2_DemodA_data1: Banks_13_14 (U1.P4), Mezz2 (J17_2.4)
m2_DemodA_data2: Banks_13_14 (U1.N3), Mezz2 (J17_2.5)
m2_DemodA_data3: Banks_13_14 (U1.N2), Mezz2 (J17_2.6)
m2_DemodA_data4: Banks_13_14 (U1.R8), Mezz2 (J17_2.7)
m2_DemodA_data5: Banks_13_14 (U1.T8), Mezz2 (J17_2.8)
m2_DemodA_data6: Banks_13_14 (U1.R7), Mezz2 (J17_2.9)
m2_DemodA_data7: Banks_13_14 (U1.R6), Mezz2 (J17_2.10)
m2_DemodA_data8: Banks_13_14 (U1.P2), Mezz2 (J17_2.11)
m2_DemodA_data9: Banks_13_14 (U1.P1), Mezz2 (J17_2.12)
m2_DemodA_data10: Banks_13_14 (U1.R4), Mezz2 (J17_2.13)
m2_DemodA_data11: Banks_13_14 (U1.T4), Mezz2 (J17_2.14)
m2_DemodA_data12: Banks_13_14 (U1.R3), Mezz2 (J17_2.15)
m2_DemodA_data13: Banks_13_14 (U1.R2), Mezz2 (J17_2.16)
m2_DemodA_data14: Banks_13_14 (U1.R1), Mezz2 (J17_2.17)
m2_DemodA_dataX: Banks_13_14 (U1.T6), Mezz2 (J17_2.18)
m2_DemodA_s0: Banks_13_14 (U1.T5), Mezz2 (J17_2.19)
m2_DemodA_s1: Banks_13_14 (U1.T3), Mezz2 (J17_2.20)
m2_DemodB_data0: Banks_11_12 (U1.AB10), Mezz2 (J17_1.50)
m2_DemodB_data1: Banks_11_12 (U1.AK3), Mezz2 (J17_1.51)
m2_DemodB_data2: Banks_11_12 (U1.AK2), Mezz2 (J17_1.52)
m2_DemodB_data3: Banks_11_12 (U1.AF8), Mezz2 (J17_1.53)
m2_DemodB_data4: Banks_11_12 (U1.AE8), Mezz2 (J17_1.54)
m2_DemodB_data5: Banks_11_12 (U1.AH5), Mezz2 (J17_1.55)
m2_DemodB_data6: Banks_11_12 (U1.AH4), Mezz2 (J17_1.56)
m2_DemodB_data7: Banks_11_12 (U1.AB13), Mezz2 (J17_1.57)
m2_DemodB_data8: Banks_11_12 (U1.AB12), Mezz2 (J17_1.58)
m2_DemodB_data9: Banks_11_12 (U1.AM2), Mezz2 (J17_1.59)
m2_DemodB_data10: Banks_11_12 (U1.AM1), Mezz2 (J17_1.60)
m2_DemodB_data11: Banks_11_12 (U1.AG8), Mezz2 (J17_1.61)
m2_DemodB_data12: Banks_11_12 (U1.AG7), Mezz2 (J17_1.62)
m2_DemodB_data13: Banks_11_12 (U1.AM3), Mezz2 (J17_1.63)
m2_DemodB_data14: Banks_11_12 (U1.AL3), Mezz2 (J17_1.64)
m2_DemodB_dataX: Banks_11_12 (U1.AC10), Mezz2 (J17_1.49)
m2_DemodB_s0: Banks_11_12 (U1.AE7), Mezz2 (J17_1.47)
m2_DemodB_s1: Banks_11_12 (U1.AD7), Mezz2 (J17_1.48)
m2_power_data0: Banks_3_4 (U1.AF18), Mezz2 (J17_2.67)
m2_power_data1: Banks_3_4 (U1.AE18), Mezz2 (J17_2.68)
m2_power_data2: Banks_3_4 (U1.AG16), Mezz2 (J17_2.69)
m2_power_data3: Banks_3_4 (U1.AF16), Mezz2 (J17_2.70)
m2_power_data4: Banks_3_4 (U1.AH19), Mezz2 (J17_2.71)
m2_power_data5: Banks_3_4 (U1.AH18), Mezz2 (J17_2.72)
m2_power_data6: Banks_3_4 (U1.AK18), Mezz2 (J17_2.73)
m2_power_data7: Banks_3_4 (U1.AK17), Mezz2 (J17_2.74 Rv2_1.2)
NetC328_1: Comm_SQUID (5 pins), SQUID_Power (C328.1 Q4.2 Q4.4)
NetC331_2: Comm_SQUID (P3.12 P3.13 P3.25), SQUID_Power (C331.2 Q6.2 Q6.4)
NetQ3_1: Power_Delivery (Q3.1 R78.1), U_Power_Delivery/BuckRegulator1 (R25_1.1 U2_1.5), U_Power_Delivery/BuckRegulator2 (R25_2.1 U2_2.5), U_Power_Delivery/BuckRegulator3 (R25_3.1 U2_3.5)
NetR75_1: Power_Delivery (R75.1 R77.1), U_Power_Delivery/BuckRegulator1 (U2_1.27), U_Power_Delivery/BuckRegulator2 (U2_2.27), U_Power_Delivery/BuckRegulator3 (U2_3.27)
NetU1_F18: Banks_3_4 (U1.F18), PHY_RJ45 (U20.2)
NetU1_H19: Banks_3_4 (U1.H19), PHY_RJ45 (U20.4)
PHY_COL: Banks_5_6 (U1.J9), PHY_RJ45 (U20.83)
PHY_CRS: Banks_5_6 (U1.B6), PHY_RJ45 (U20.84)
PHY_INT: Banks_5_6 (U1.H8), PHY_RJ45 (R52.2 U20.23)
PHY_MDC: Banks_5_6 (U1.C13), PHY_RJ45 (U20.25)
PHY_MDIO: Banks_5_6 (U1.G7), PHY_RJ45 (R56.2 U20.24)
PHY_RESET: Banks_5_6 (U1.D12), PHY_RJ45 (U20.28)
PHY_RXCTL_RXDV: Banks_5_6 (U1.H12), PHY_RJ45 (U20.94)
PHY_RXD0: Banks_5_6 (U1.F6), PHY_RJ45 (U20.95)
PHY_RXD1: Banks_5_6 (U1.E6), PHY_RJ45 (U20.92)
PHY_RXD2: Banks_5_6 (U1.G8), PHY_RJ45 (U20.93)
PHY_RXD3: Banks_5_6 (U1.F8), PHY_RJ45 (U20.91)
PHY_RXD4: Banks_5_6 (U1.A9), PHY_RJ45 (U20.90)
PHY_RXD5: Banks_5_6 (U1.A10), PHY_RJ45 (U20.89)
PHY_RXD6: Banks_5_6 (U1.C7), PHY_RJ45 (U20.87)
PHY_RXD7: Banks_5_6 (U1.B7), PHY_RJ45 (U20.86)
PHY_RXER: Banks_5_6 (U1.J11), PHY_RJ45 (U20.3)
PHY_TXC_GTXCLK: Banks_5_6 (R71.2), PHY_RJ45 (U20.8)
PHY_TXCTL_TXEN: Banks_5_6 (R40.2), PHY_RJ45 (U20.9)
PHY_TXD0: Banks_5_6 (R34.2), PHY_RJ45 (U20.11)
PHY_TXD1: Banks_5_6 (R35.2), PHY_RJ45 (U20.12)
PHY_TXD2: Banks_5_6 (R36.2), PHY_RJ45 (U20.14)
PHY_TXD3: Banks_5_6 (R37.2), PHY_RJ45 (U20.16)
PHY_TXD4: Banks_5_6 (R44.2), PHY_RJ45 (R47.1 U20.17)
PHY_TXD5: Banks_5_6 (R45.2), PHY_RJ45 (R41.1 U20.18)
PHY_TXD6: Banks_5_6 (R38.2), PHY_RJ45 (R42.1 U20.19)
PHY_TXD7: Banks_5_6 (R39.2), PHY_RJ45 (R43.1 U20.20)
PHY_TXER: Banks_5_6 (R46.2), PHY_RJ45 (U20.7)
POWER_DATA0: Banks_1_2 (U1.AL14), Housekeeping (UP1.14), U_Housekeeping/TemperatureSens1 (UTemp_1.2), U_Housekeeping/TemperatureSens2 (UTemp_2.2), U_Housekeeping/TemperatureSens3 (UTemp_3.2)
POWER_DATA1: Banks_1_2 (U1.AH22), Housekeeping (UP1.16), U_Housekeeping/TemperatureSens1 (UTemp_1.4), U_Housekeeping/TemperatureSens2 (UTemp_2.4), U_Housekeeping/TemperatureSens3 (UTemp_3.4)
POWER_DATA2: Banks_1_2 (U1.AG22), Housekeeping (UP1.1)
POWER_DATA4: Banks_1_2 (U1.AC15), Housekeeping (D1.1)
POWER_DATA_OUT: Banks_1_2 (U1.AK14), Housekeeping (UP1.15), U_Housekeeping/TemperatureSens1 (UTemp_1.6), U_Housekeeping/TemperatureSens2 (UTemp_2.6), U_Housekeeping/TemperatureSens3 (UTemp_3.6)
RS485A_DE: Banks_1_2 (U1.AH14), Comm_SQUID (U7.2 U7.3)
RS485A_DI: Banks_1_2 (U1.AG15), Comm_SQUID (U7.4)
RS485A_RO: Banks_1_2 (U1.AD19), Comm_SQUID (U7.1)
RS485B_DE: Banks_1_2 (U1.AL16), Comm_SQUID (U6.2 U6.3)
RS485B_DI: Banks_1_2 (U1.AE19), Comm_SQUID (U6.4)
RS485B_RO: Banks_1_2 (U1.AK16), Comm_SQUID (U6.1)
SQUID9V_EN: Banks_7_8 (U1.AP4), Comm_SQUID (R501.1), SQUID_Power (U11.2 U14.2)
SQUID_8V5N: Housekeeping (RP19.1), Comm_SQUID (P3.6 P3.19), SQUID_Power (C337.2 R165.2 U14.5)
SQUID_8V5P: Housekeeping (RP12.2), Comm_SQUID (P3.4 P3.17), SQUID_Power (C334.1 R163.2 U11.5)
SYSACE_CLK: Clock_distrubution (R4.2), SysACE_SysFLASH (U22.93)
SYSACE_MPA0: Banks_7_8 (R83.2 U1.AP5), SysACE_SysFLASH (U22.70)
SYSACE_MPA1: Banks_7_8 (U1.AM12), SysACE_SysFLASH (U22.69)
SYSACE_MPA2: Banks_7_8 (U1.AM11), SysACE_SysFLASH (U22.68)
SYSACE_MPA3: Banks_7_8 (U1.AL9), SysACE_SysFLASH (U22.67)
SYSACE_MPA4: Banks_7_8 (U1.AE9), SysACE_SysFLASH (U22.45)
SYSACE_MPA5: Banks_7_8 (U1.AJ12), SysACE_SysFLASH (U22.44)
SYSACE_MPA6: Banks_7_8 (U1.AK12), SysACE_SysFLASH (U22.43)
SYSACE_MPBRDY: Banks_7_8 (U1.AN5), SysACE_SysFLASH (U22.39)
SYSACE_MPCE: Banks_7_8 (U1.AN8), SysACE_SysFLASH (U22.42)
SYSACE_MPIRQ: Banks_7_8 (U1.AM8), SysACE_SysFLASH (U22.41)
SYSACE_MPOE_USB_RD_N: Banks_7_8 (U1.AE11), SysACE_SysFLASH (U22.77)
SYSACE_MPWE_USB_WR_N: Banks_7_8 (U1.AF11), SysACE_SysFLASH (U22.76)
SYSACE_RESET_N: SysACE_SysFLASH (J20.2 R82.1 SW3.2 U22.33), Watchdog_Reset (R127.1 R128.1 R131.2)
SYSACE_USB_D0: Banks_7_8 (U1.AK9), SysACE_SysFLASH (U22.66)
SYSACE_USB_D1: Banks_7_8 (U1.AP11), SysACE_SysFLASH (U22.65)
SYSACE_USB_D2: Banks_7_8 (U1.AP10), SysACE_SysFLASH (U22.63)
SYSACE_USB_D3: Banks_7_8 (U1.AH10), SysACE_SysFLASH (U22.62)
SYSACE_USB_D4: Banks_7_8 (U1.AG10), SysACE_SysFLASH (U22.61)
SYSACE_USB_D5: Banks_7_8 (U1.AN12), SysACE_SysFLASH (U22.60)
SYSACE_USB_D6: Banks_7_8 (U1.AP12), SysACE_SysFLASH (U22.59)
SYSACE_USB_D7: Banks_7_8 (U1.AP9), SysACE_SysFLASH (U22.58)
SYSACE_USB_D8: Banks_7_8 (U1.AN9), SysACE_SysFLASH (U22.56)
SYSACE_USB_D9: Banks_7_8 (U1.AH12), SysACE_SysFLASH (U22.53)
SYSACE_USB_D10: Banks_7_8 (U1.AG11), SysACE_SysFLASH (U22.52)
SYSACE_USB_D11: Banks_7_8 (U1.AN7), SysACE_SysFLASH (U22.51)
SYSACE_USB_D12: Banks_7_8 (U1.AM7), SysACE_SysFLASH (U22.50)
SYSACE_USB_D13: Banks_7_8 (U1.AN10), SysACE_SysFLASH (U22.49)
SYSACE_USB_D14: Banks_7_8 (U1.AM10), SysACE_SysFLASH (U22.48)
SYSACE_USB_D15: Banks_7_8 (U1.AF10), SysACE_SysFLASH (U22.47)
SYSCLK_25MHZ: Banks_1_2 (U1.AM17), Clock_distrubution (R3.2), PHY_RJ45 (R454.2 Uphy.3)
Temp_HIGH: Banks_7_8 (U1.AN14), SysACE_SysFLASH (R500.2 UC1.5)
USERCLK: Banks_1_2 (U1.AB16 U1.AB17), UserClock (U5.3)
VME_A1: Banks_9_10 (U1.J29 U1.J30), Eurocard VME 6U P1 (RT15.8)
VME_A2: Banks_9_10 (U1.E32 U1.E33), Eurocard VME 6U P1 (RT15.7)
VME_A3: Banks_9_10 (U1.N25 U1.P26), Eurocard VME 6U P1 (RT15.6)
VME_A4: Banks_9_10 (U1.P22 U1.R21), Eurocard VME 6U P1 (RT15.5)
VME_A5: Banks_9_10 (U1.F33 U1.F34), Eurocard VME 6U P1 (RT15.4)
VME_A6: Banks_9_10 (U1.K28 U1.K29), Eurocard VME 6U P1 (RT15.3)
VME_A7: Banks_9_10 (U1.G32 U1.G33), Eurocard VME 6U P1 (RT15.2)
VME_A8: Banks_9_10 (U1.K6 U1.L6), Eurocard VME 6U P1 (RT18.8)
VME_A9: Banks_9_10 (U1.L8 U1.M8), Eurocard VME 6U P1 (RT18.7)
VME_A10: Banks_9_10 (U1.G2 U1.G3), Eurocard VME 6U P1 (RT18.6)
VME_A11: Banks_9_10 (U1.P11 U1.P12), Eurocard VME 6U P1 (RT18.5)
VME_A12: Banks_9_10 (U1.N9 U1.N10), Eurocard VME 6U P1 (RT18.4)
VME_A13: Banks_9_10 (U1.H4 U1.H5), Eurocard VME 6U P1 (RT18.3)
VME_A14: Banks_9_10 (U1.J5 U1.J6), Eurocard VME 6U P1 (RT18.2)
VME_A15: Banks_9_10 (U1.E2 U1.E3), Eurocard VME 6U P1 (RT18.1)
VME_A16: Banks_9_10 (U1.D1 U1.E1), Eurocard VME 6U P1 (RT17.8)
VME_A17: Banks_9_10 (U1.C2 U1.D2), Eurocard VME 6U P1 (RT17.7)
VME_A18: Banks_9_10 (U1.F3 U1.F4), Eurocard VME 6U P1 (RT17.6)
VME_A19: Banks_9_10 (U1.N12 U1.N13), Eurocard VME 6U P1 (RT17.5)
VME_A20: Banks_9_10 (U1.L9 U1.M10), Eurocard VME 6U P1 (RT17.4)
VME_A21: Banks_9_10 (U1.D4 U1.E4), Eurocard VME 6U P1 (RT17.3)
VME_A22: Banks_9_10 (U1.F5 U1.G5), Eurocard VME 6U P1 (RT17.2)
VME_A23: Banks_9_10 (U1.C3 U1.C4), Eurocard VME 6U P1 (RT17.1)
VME_ACFAIL: Banks_9_10 (U1.H2 U1.H3), Eurocard VME 6U P1 (R124.1)
VME_AM0: Banks_9_10 (U1.P24 U1.R24), Eurocard VME 6U P1 (RT20.5)
VME_AM1: Banks_9_10 (U1.H32 U1.J32), Eurocard VME 6U P1 (RT20.6)
VME_AM2: Banks_9_10 (U1.M27 U1.M28), Eurocard VME 6U P1 (RT20.7)
VME_AM3: Banks_9_10 (U1.H33 U1.H34), Eurocard VME 6U P1 (RT20.8)
VME_AM4: Banks_9_10 (U1.L30 U1.L31), Eurocard VME 6U P1 (RT15.1)
VME_AM5: Banks_9_10 (U1.R22 U1.R23), Eurocard VME 6U P1 (RT16.12)
VME_AS: Banks_9_10 (U1.H29 U1.H30), Eurocard VME 6U P1 (RT14.5)
VME_BBSY: Banks_9_10 (U1.F1 U1.G1), Eurocard VME 6U P1 (R120.1)
VME_BCLR: Banks_9_10 (U1.J4 U1.K4), Eurocard VME 6U P1 (R121.1)
VME_BERR: Banks_9_10 (U1.L28 U1.L29), Eurocard VME 6U P1 (RT16.15)
VME_BGIN0: Banks_9_10 (U1.K3 U1.L3), Eurocard VME 6U P1 (RT19.1)
VME_BGIN1: Banks_9_10 (U1.K1 U1.K2), Eurocard VME 6U P1 (RT19.3)
VME_BGIN2: Banks_9_10 (U1.M5 U1.M6), Eurocard VME 6U P1 (RT19.5)
VME_BGIN3: Banks_9_10 (U1.M2 U1.M3), Eurocard VME 6U P1 (RT19.7)
VME_BGOUT0: Banks_9_10 (U1.P9 U1.P10), Eurocard VME 6U P1 (RT19.2)
VME_BGOUT1: Banks_9_10 (U1.M7 U1.N7), Eurocard VME 6U P1 (RT19.4)
VME_BGOUT2: Banks_9_10 (U1.L4 U1.L5), Eurocard VME 6U P1 (RT19.6)
VME_BGOUT3: Banks_9_10 (U1.R11 U1.T11), Eurocard VME 6U P1 (RT19.8)
VME_BR0: Banks_9_10 (U1.L1 U1.M1), Eurocard VME 6U P1 (RT20.1)
VME_BR1: Banks_9_10 (U1.N5 U1.P5), Eurocard VME 6U P1 (RT20.2)
VME_BR2: Banks_9_10 (U1.P6 U1.P7), Eurocard VME 6U P1 (RT20.3)
VME_BR3: Banks_9_10 (U1.R9 U1.T10), Eurocard VME 6U P1 (RT20.4)
VME_D0: Banks_7_8 (U1.AL24), Eurocard VME 6U P1 (U27.2)
VME_D1: Banks_7_8 (U1.AM28), Eurocard VME 6U P1 (U27.3)
VME_D2: Banks_7_8 (U1.AN28), Eurocard VME 6U P1 (U27.5)
VME_D3: Banks_7_8 (U1.AH24), Eurocard VME 6U P1 (U27.6)
VME_D4: Banks_7_8 (U1.AH23), Eurocard VME 6U P1 (U27.8)
VME_D5: Banks_7_8 (U1.AG26), Eurocard VME 6U P1 (U27.9)
VME_D6: Banks_7_8 (U1.AG25), Eurocard VME 6U P1 (U27.11)
VME_D7: Banks_7_8 (U1.AF24), Eurocard VME 6U P1 (U27.12)
VME_D8: Banks_7_8 (U1.AG23), Eurocard VME 6U P1 (U27.13)
VME_D9: Banks_7_8 (U1.AK28), Eurocard VME 6U P1 (U27.14)
VME_D10: Banks_7_8 (U1.AK27), Eurocard VME 6U P1 (U27.16)
VME_D11: Banks_7_8 (U1.AJ24), Eurocard VME 6U P1 (U27.17)
VME_D12: Banks_7_8 (U1.AK24), Eurocard VME 6U P1 (U27.19)
VME_D13: Banks_7_8 (U1.AN29), Eurocard VME 6U P1 (U27.20)
VME_D14: Banks_7_8 (U1.AP29), Eurocard VME 6U P1 (U27.22)
VME_D15: Banks_7_8 (U1.AP22), Eurocard VME 6U P1 (U27.23)
VME_D_OE: Banks_7_8 (U1.AJ27), Eurocard VME 6U P1 (R112.2 U27.25 U27.48)
VME_D_TR: Banks_7_8 (U1.AH27), Eurocard VME 6U P1 (R118.2 U27.1 U27.24)
VME_DS0: Banks_9_10 (U1.C32 U1.D32), Eurocard VME 6U P1 (RT14.2)
VME_DS1: Banks_9_10 (U1.H27 U1.H28), Eurocard VME 6U P1 (RT14.1)
VME_DTACK: Banks_9_10 (U1.M26 U1.N22 U1.N23), Eurocard VME 6U P1 (RT14.4)
VME_IACK: Banks_9_10 (U1.C33 U1.C34), Eurocard VME 6U P1 (RT14.6)
VME_IACKIN: Banks_9_10 (U1.D34 U1.E34), Eurocard VME 6U P1 (RT14.7)
VME_IACKOUT: Banks_9_10 (U1.G30 U1.G31), Eurocard VME 6U P1 (RT14.8)
VME_IRQ1: Banks_9_10 (U1.M32 U1.M33), Eurocard VME 6U P1 (RT21.8)
VME_IRQ2: Banks_9_10 (U1.L33 U1.L34), Eurocard VME 6U P1 (RT21.7)
VME_IRQ3: Banks_9_10 (U1.N29 U1.N30), Eurocard VME 6U P1 (RT21.6)
VME_IRQ4: Banks_9_10 (U1.J34 U1.K34), Eurocard VME 6U P1 (RT21.5)
VME_IRQ5: Banks_9_10 (U1.M30 U1.M31), Eurocard VME 6U P1 (RT21.4)
VME_IRQ6: Banks_9_10 (U1.N27 U1.P27), Eurocard VME 6U P1 (RT21.3)
VME_IRQ7: Banks_9_10 (U1.K32 U1.K33), Eurocard VME 6U P1 (RT21.2)
VME_LWORD: Banks_9_10 (U1.P20 U1.R19), Eurocard VME 6U P1 (RT16.13)
VME_SERA: Clock_distrubution (R116.1), Eurocard VME 6U P1 (P1.B21)
VME_SERB: Clock_distrubution (R117.1), Eurocard VME 6U P1 (P1.B22)
VME_SYSCLK: Clock_distrubution (R113.1 R115.1), Eurocard VME 6U P1 (R119.1)
VME_SYSFAIL: Power_Delivery (R76.1), U_Power_Delivery/BuckRegulator1 (R47_1.1), U_Power_Delivery/BuckRegulator2 (R47_2.1), U_Power_Delivery/BuckRegulator3 (R47_3.1), Linear_Pos_regulator (R155.1), Eurocard VME 6U P1 (RT16.16)
VME_SYSRESET: Eurocard VME 6U P1 (RT16.14), Watchdog_Reset (J24.1 R134.1 U29.5)
VME_UD0: Banks_7_8 (U1.AP25), Eurocard VME 6U P2 (RT11.1)
VME_UD1: Banks_7_8 (U1.AL29), Eurocard VME 6U P2 (RT11.2)
VME_UD2: Banks_7_8 (U1.AL28), Eurocard VME 6U P2 (RT11.3)
VME_UD3: Banks_7_8 (U1.AK23), Eurocard VME 6U P2 (RT11.4)
VME_UD4: Banks_7_8 (U1.AK22), Eurocard VME 6U P2 (RT11.5)
VME_UD5: Banks_7_8 (U1.AP32), Eurocard VME 6U P2 (RT11.6)
VME_UD6: Banks_7_8 (U1.AP31), Eurocard VME 6U P2 (RT11.7)
VME_UD7: Banks_7_8 (U1.AN27), Eurocard VME 6U P2 (RT11.8)
VME_UD8: Banks_7_8 (U1.AP27), Eurocard VME 6U P2 (RT12.1)
VME_UD9: Banks_7_8 (U1.AL30), Eurocard VME 6U P2 (RT12.2)
VME_UD10: Banks_7_8 (U1.AM30), Eurocard VME 6U P2 (RT12.3)
VME_UD11: Banks_7_8 (U1.AN30), Eurocard VME 6U P2 (RT12.4)
VME_UD12: Banks_7_8 (U1.AP30), Eurocard VME 6U P2 (RT12.5)
VME_UD13: Banks_7_8 (U1.AH29), Eurocard VME 6U P2 (RT12.6)
VME_UD14: Banks_7_8 (U1.AH28), Eurocard VME 6U P2 (RT12.7)
VME_UD15: Banks_7_8 (U1.AL21), Eurocard VME 6U P2 (RT12.8)
VME_UD16: Banks_7_8 (U1.AK21), Eurocard VME 6U P2 (RT13.1)
VME_UD17: Banks_7_8 (U1.AN32), Eurocard VME 6U P2 (RT13.2)
VME_UD18: Clock_distrubution (R117.2 U4.7), Eurocard VME 6U P2 (RT13.3)
VME_UD19: Clock_distrubution (R116.2 U4.6), Eurocard VME 6U P2 (RT13.4)
VME_WRITE: Banks_9_10 (U1.J27 U1.K27), Eurocard VME 6U P1 (RT14.3)